# Altium schematic sheet Cell Balancing.SchDoc
size A4; Organization: Waterloop; Address1: 200 University Ave W; Address2: Engineering 5, 1104; Address3: Waterloo, ON; Address4: N2L 3G1; SheetNumber: 2; SheetTotal: 5
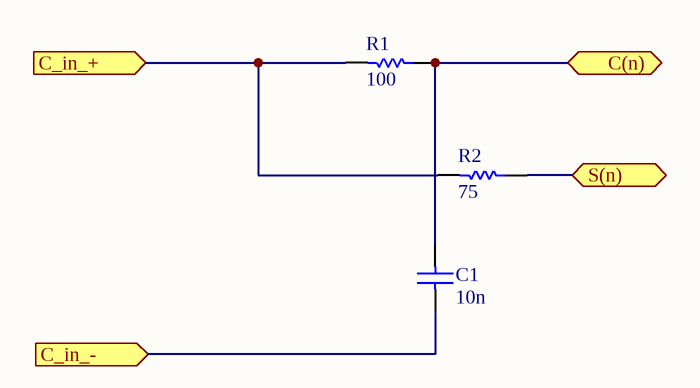
[diagram p0: Cell Balancing.SchDoc]

## Parts
C1  value 10n  [0603 - Capacitor]  (hidden comment: Capacitor - Nonpolarized)
R1  value 100  [0805 - Resistor]  (hidden comment: Resistor)
R2  value 75  [0805 - Resistor]  (hidden comment: Resistor)

## Ports
C(n) (bidir, see Monitoring IC[3C]), C_in_+ (in, see Monitoring IC[4C]), C_in_- (in, see Monitoring IC[4D]), S(n) (bidir, see Monitoring IC[3D])

## Nets
C(n): C1.2 R1.1 ; port C(n)
C_in_+: R1.2 R2.2 ; port C_in_+
C_in_-: C1.1 ; port C_in_-
S(n): R2.1 ; port S(n)

## Notes on the sheet
- Title:
- Size:
- Date:
- A4
- Author:
- Revision:
- Sheet
- of
- File:

## Library data of the parts
C1 = Capacitor - Nonpolarized: Nonpolarized Capacitor; Supplier: *; Supplier Part Number: *; Rating: *; Manufacturer: *; Manufacturer Part Number: *
R1 R2 = Resistor: Rating: *; Manufacturer Part Number: *; Manufacturer: *; Supplier Part Number: *; Supplier: *